# EAGLE design powersupply (EAGLE 9.4.2)
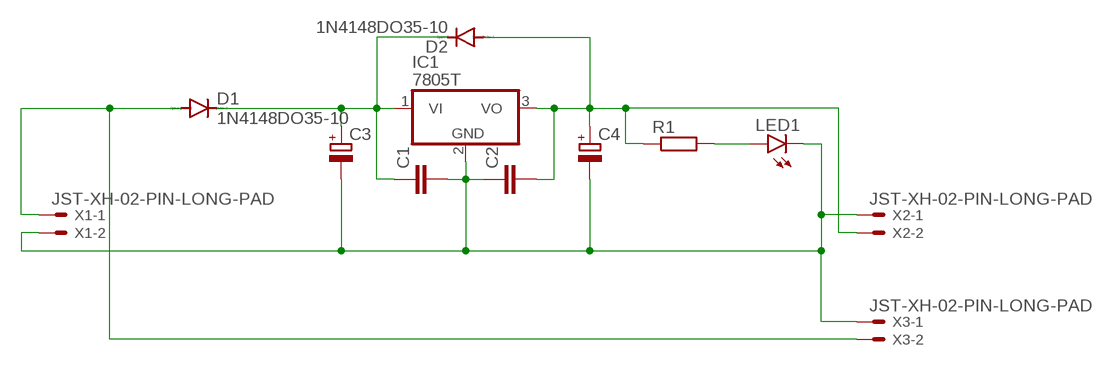
[diagram p0: schematic, sheet 1]

## Parts
C1  C-EU025-024X044  [C025-024X044]
C2  C-EU025-024X044  [C025-024X044]
C3  CPOL-EUE2,5-6E  [E2,5-6E]
C4  CPOL-EUE2,5-6E  [E2,5-6E]
D1  1N4148DO35-10  [DO35-10]
D2  1N4148DO35-10  [DO35-10]
IC1  7805T  [TO220H]
LED1  LED5MM  [LED5MM]
R1  R-EU_0207/10  [0207/10]
X1  JST-XH-02-PIN-LONG-PAD  [JST-XH-02-PACKAGE-LONG-PAD]
X2  JST-XH-02-PIN-LONG-PAD  [JST-XH-02-PACKAGE-LONG-PAD]
X3  JST-XH-02-PIN-LONG-PAD  [JST-XH-02-PACKAGE-LONG-PAD]

## Nets
GND: C1.2 C2.1 C3.- C4.- IC1.2(GND) LED1.K(C) X1.2 X2.1 X3.1
N$1: D1.A X1.1 X3.2
N$2: C1.1 C3.+ D1.C D2.C IC1.1(VI)
N$4: C2.2 C4.+ D2.A IC1.3(VO) R1.1 X2.2
N$6: LED1.A R1.2

## Library data of the parts
C1 C2 = rcl:C-EU: CAPACITOR, European symbol; SPICEPREFIX: C
C3 C4 = rcl:CPOL-EU: POLARIZED CAPACITOR, European symbol; SPICEPREFIX: C
D1 D2 = diode:1N4148: DIODE high speed (Philips)
IC1 = linear:78*: Positive VOLTAGE REGULATOR Source: http://cache.national.com/ds/LM/LM78L05.pdf http://www.fairchildsemi.com/ds/LM/LM7805.pdf
LED1 = led:LED: LED OSRAM: - CHIPLED LG R971, LG N971, LY N971, LG Q971, LY Q971, LO R971, LY R971 LH N974, LH R974 LS Q976, LO Q976, LY Q976 LO Q996 - Hyper CHIPLED LW Q18S LB Q993, LB Q99A, LB R99A - SideLED LS A670, LO A670, LY A670, LG A670, LP A670 LB A673, LV A673, LT A673, LW A673 LH A674 LY A675 LS A676, LA A676, LO A676, LY A676, LW A676 LS A679, LY A679, LG A679 - Hyper Micro SIDELED® LS Y876, LA Y876, LO Y876, LY Y876 LT Y87S - SmartLED LW L88C, LW L88S LB L89C, LB L89S, LG L890 LS L89K, LO L89K, LY L89K LS L896, LA L896, LO L896, LY L896 - TOPLED LS T670, LO T670, LY T670, LG T670, LP T670 LSG T670, LSP T670, LSY T670, LOP T670, LYG T670 LG T671, LOG T671, LSG T671 LB T673, LV T673, LT T673, LW T673 LH T674 LS T676, LA T676, LO T676, LY T676, LB T676, LH T676, LSB T676, LW T676 LB T67C, LV T67C, LT T67C, LS T67K, LO T67K, LY T67K, LW E67C LS E67B, LA E67B, LO E67B, LY E67B, LB E67C, LV E67C, LT E67C LW T67C LS T679, LY T679, LG T679 LS T770, LO T770, LY T770, LG T770, LP T770 LB T773, LV T773, LT T773, LW T773 LH T774 LS E675, LA E675, LY E675, LS T675 LS T776, LA T776, LO T776, LY T776, LB T776 LHGB T686 LT T68C, LB T68C - Hyper Mini TOPLED® LB M676 - Mini TOPLED Santana® LG M470 LS M47K, LO M47K, LY M47K Source: http://www.osram.convergy.de LUXEON: - LUMILED® LXK2-PW12-R00, LXK2-PW12-S00, LXK2-PW14-U00, LXK2-PW14-V00 LXK2-PM12-R00, LXK2-PM12-S00, LXK2-PM14-U00 LXK2-PE12-Q00, LXK2-PE12-R00, LXK2-PE12-S00, LXK2-PE14-T00, LXK2-PE14-U00 LXK2-PB12-K00, LXK2-PB12-L00, LXK2-PB12-M00, LXK2-PB14-N00, LXK2-PB14-P00, LXK2-PB14-Q00 LXK2-PR12-L00, LXK2-PR12-M00, LXK2-PR14-Q00, LXK2-PR14-R00 LXK2-PD12-Q00, LXK2-PD12-R00, LXK2-PD12-S00 LXK2-PH12-R00, LXK2-PH12-S00 LXK2-PL12-P00, LXK2-PL12-Q00, LXK2-PL12-R00 Source: www.luxeon.com KINGBRIGHT: KA-3528ASYC Source: www.kingbright.com
R1 = rcl:R-EU_: RESISTOR, European symbol; SPICEPREFIX: R
X1-X3 = Rembrandt Electronics - JST XH Connectors v1-0:JST-XH-02-PIN: JST XH Connector 2 Pin Wire to board connector. Pitch: 2,54 mm, (0.100") Number of pins: 2 Created by Rembrandt Electronics www.rembrandtelectronics.com

## Board
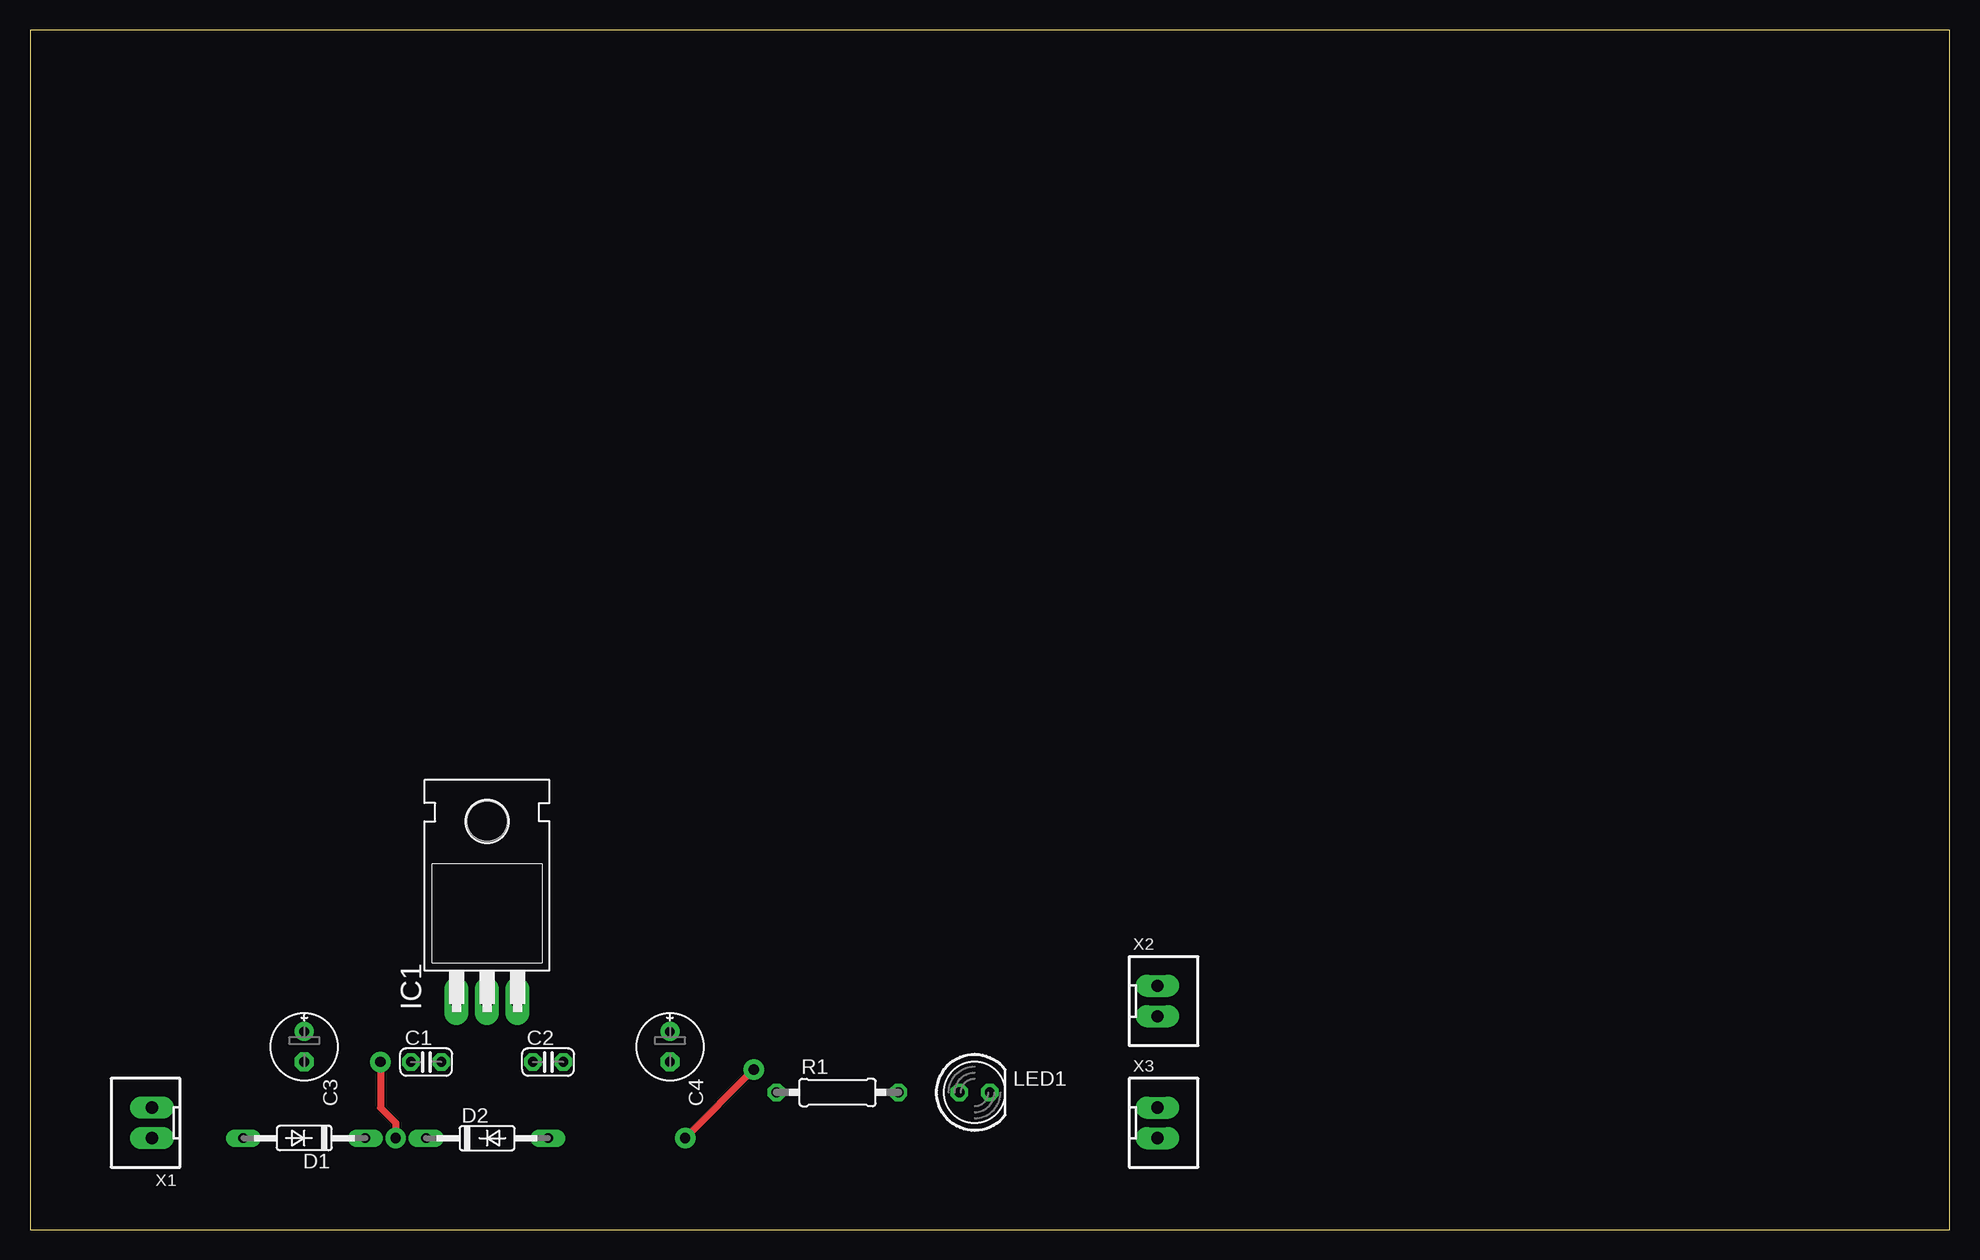
[diagram p1: board, top side]
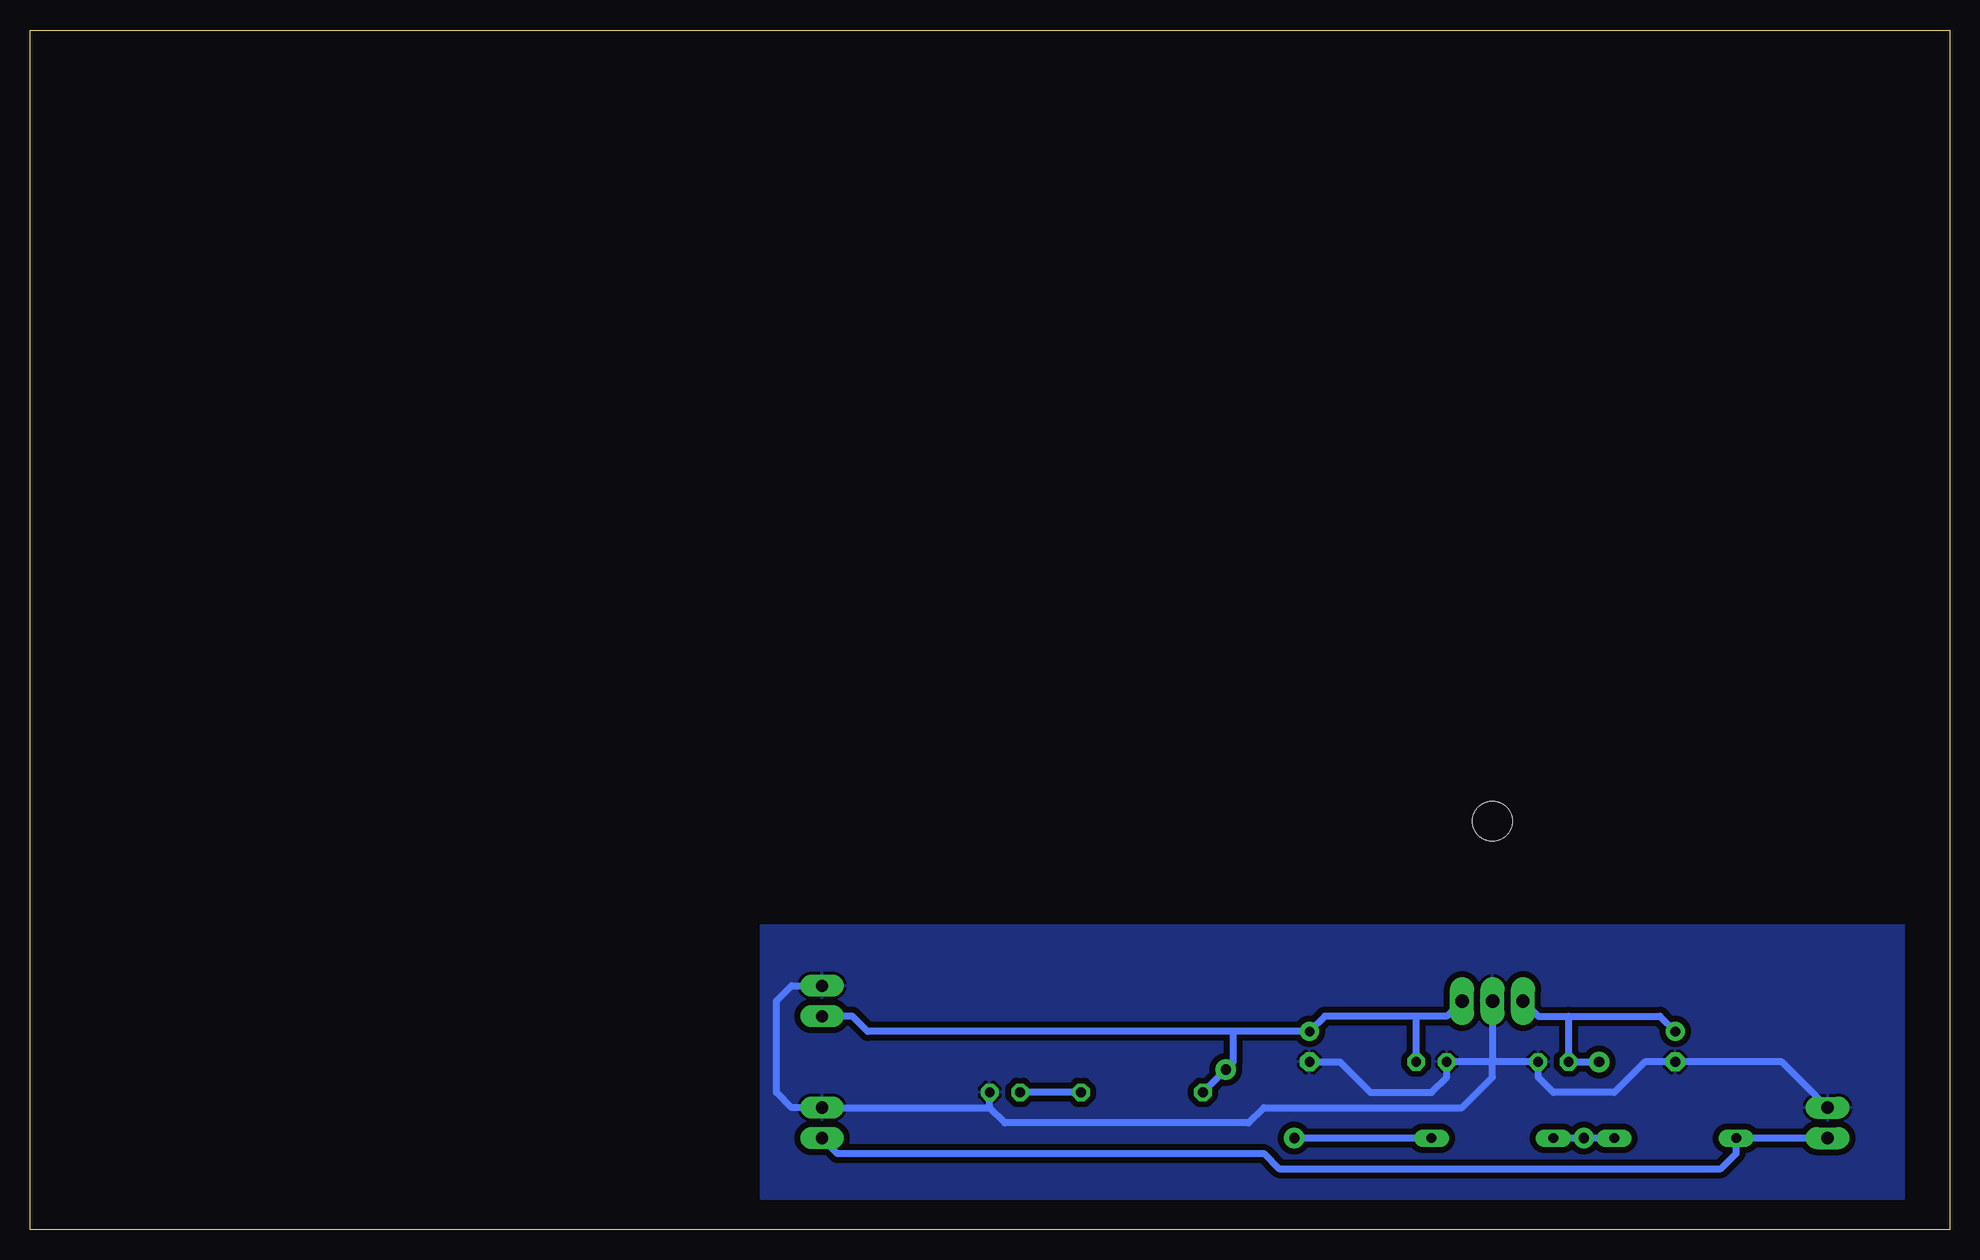
[diagram p2: board, bottom side, seen from below]

Size 160 x 100 mm. Coordinates in mm from the lower left corner, seen from the top.
Outline: 0,0 160,0 160,100 0,100 0,0
Copper layers (1*16): Top 0.035mm / dielectric 1.5mm / Bottom 0.035mm
Design rules "default *": minimum track width 6mil, minimum drill 0.35mm, track to track 6mil, track to pad 6mil, pad to pad 6mil, via to via 6mil, smd to smd 6mil, copper to edge 40mil, drill to drill 6mil, minimum pad ring 10mil, minimum via ring 8mil, stop-mask expansion 4mil, vias tented up to drill 0mil, thermal gap 10mil

### Footprints (pad centres in the part's own frame; a part is rotated, then mirrored left to right if it is on the bottom)
C025-024X044 = drill 0.813 octagon: 1 -1.27,0; 2 1.27,0
E2,5-6E = drill 0.813 pad 1.575: + -1.27,0 | drill 0.813 pad 1.575 octagon: - 1.27,0
DO35-10 = drill 0.813 long: A 5.08,0; C -5.08,0
TO220H = drill 1.118 long: 1 -2.54,-10.16; 2 0,-10.16; 3 2.54,-10.16 | hole 3.302: 0,4.826
LED5MM = drill 0.813 octagon: A -1.27,0; K 1.27,0
0207/10 = drill 0.813 octagon: 1 -5.08,0; 2 5.08,0
JST-XH-02-PACKAGE-LONG-PAD = drill 1.016 long: 1 -1.27,0; 2 1.27,0

### Placement (x,y rotation side)
C1  33.02,13.97 0 top
C2  43.18,13.97 0 top
C3  22.86,15.24 270 top
C4  53.34,15.24 270 top
D1  22.86,7.62 180 top
D2  38.1,7.62 0 top
IC1  38.1,29.21 0 top
LED1  78.74,11.43 0 top
R1  67.31,11.43 0 top
X1  10.16,8.89 90 top
X2  93.98,19.05 270 top
X3  93.98,8.89 270 top

### Tracks (layer width: path | path; a pad name or v marks a point on that pad's centre or on a via)
GND
  Bottom 0.6: X1.2 13.97,13.97 C3.- 25.4,13.97 27.94,11.43 33.02,11.43 34.29,12.7 C1.2 38.1,13.97 | 38.1,13.97 C2.1 41.91,12.7 43.18,11.43 48.26,11.43 50.8,13.97 C4.- | IC1.2 38.1,13.97 | 80.01,10.16 78.74,8.89 58.42,8.89 57.15,10.16 40.64,10.16 38.1,12.7 38.1,13.97 | 80.01,10.16 LED1.K | 80.01,10.16 X3.1 96.52,10.16 97.79,11.43 97.79,19.05 96.52,20.32 X2.1
  pour Bottom (isolate 0.5): 3.81,2.54 99.06,2.54 99.06,25.4 3.81,25.4
N$1
  Bottom 0.6: X1.1 D1.A 17.78,6.35 19.05,5.08 55.88,5.08 57.15,6.35 92.71,6.35 X3.2
N$2  (via drill 0.85)
  Top 0.6: v29.21,13.97 29.21,10.16 30.48,8.89 v30.48,7.62
  Bottom 0.6: D1.C v30.48,7.62 D2.C | IC1.1 34.29,17.78 31.75,17.78 | 31.75,17.78 24.13,17.78 C3.+ | 31.75,17.78 C1.1 v29.21,13.97
N$4  (via drill 0.85)
  Top 0.6: v54.61,7.62 v60.33,13.34
  Bottom 0.6: IC1.3 41.91,17.78 44.45,17.78 | 44.45,17.78 52.07,17.78 C4.+ 59.69,16.51 | C2.2 44.45,17.78 | 59.69,16.51 90.17,16.51 91.44,17.78 X2.2 | R1.1 v60.33,13.34 59.69,13.97 59.69,16.51 | D2.A v54.61,7.62
N$6
  Bottom 0.6: R1.2 LED1.A